# EAGLE schematic CampLight (EAGLE 6.5.0)
Camp Lamp Marky's House
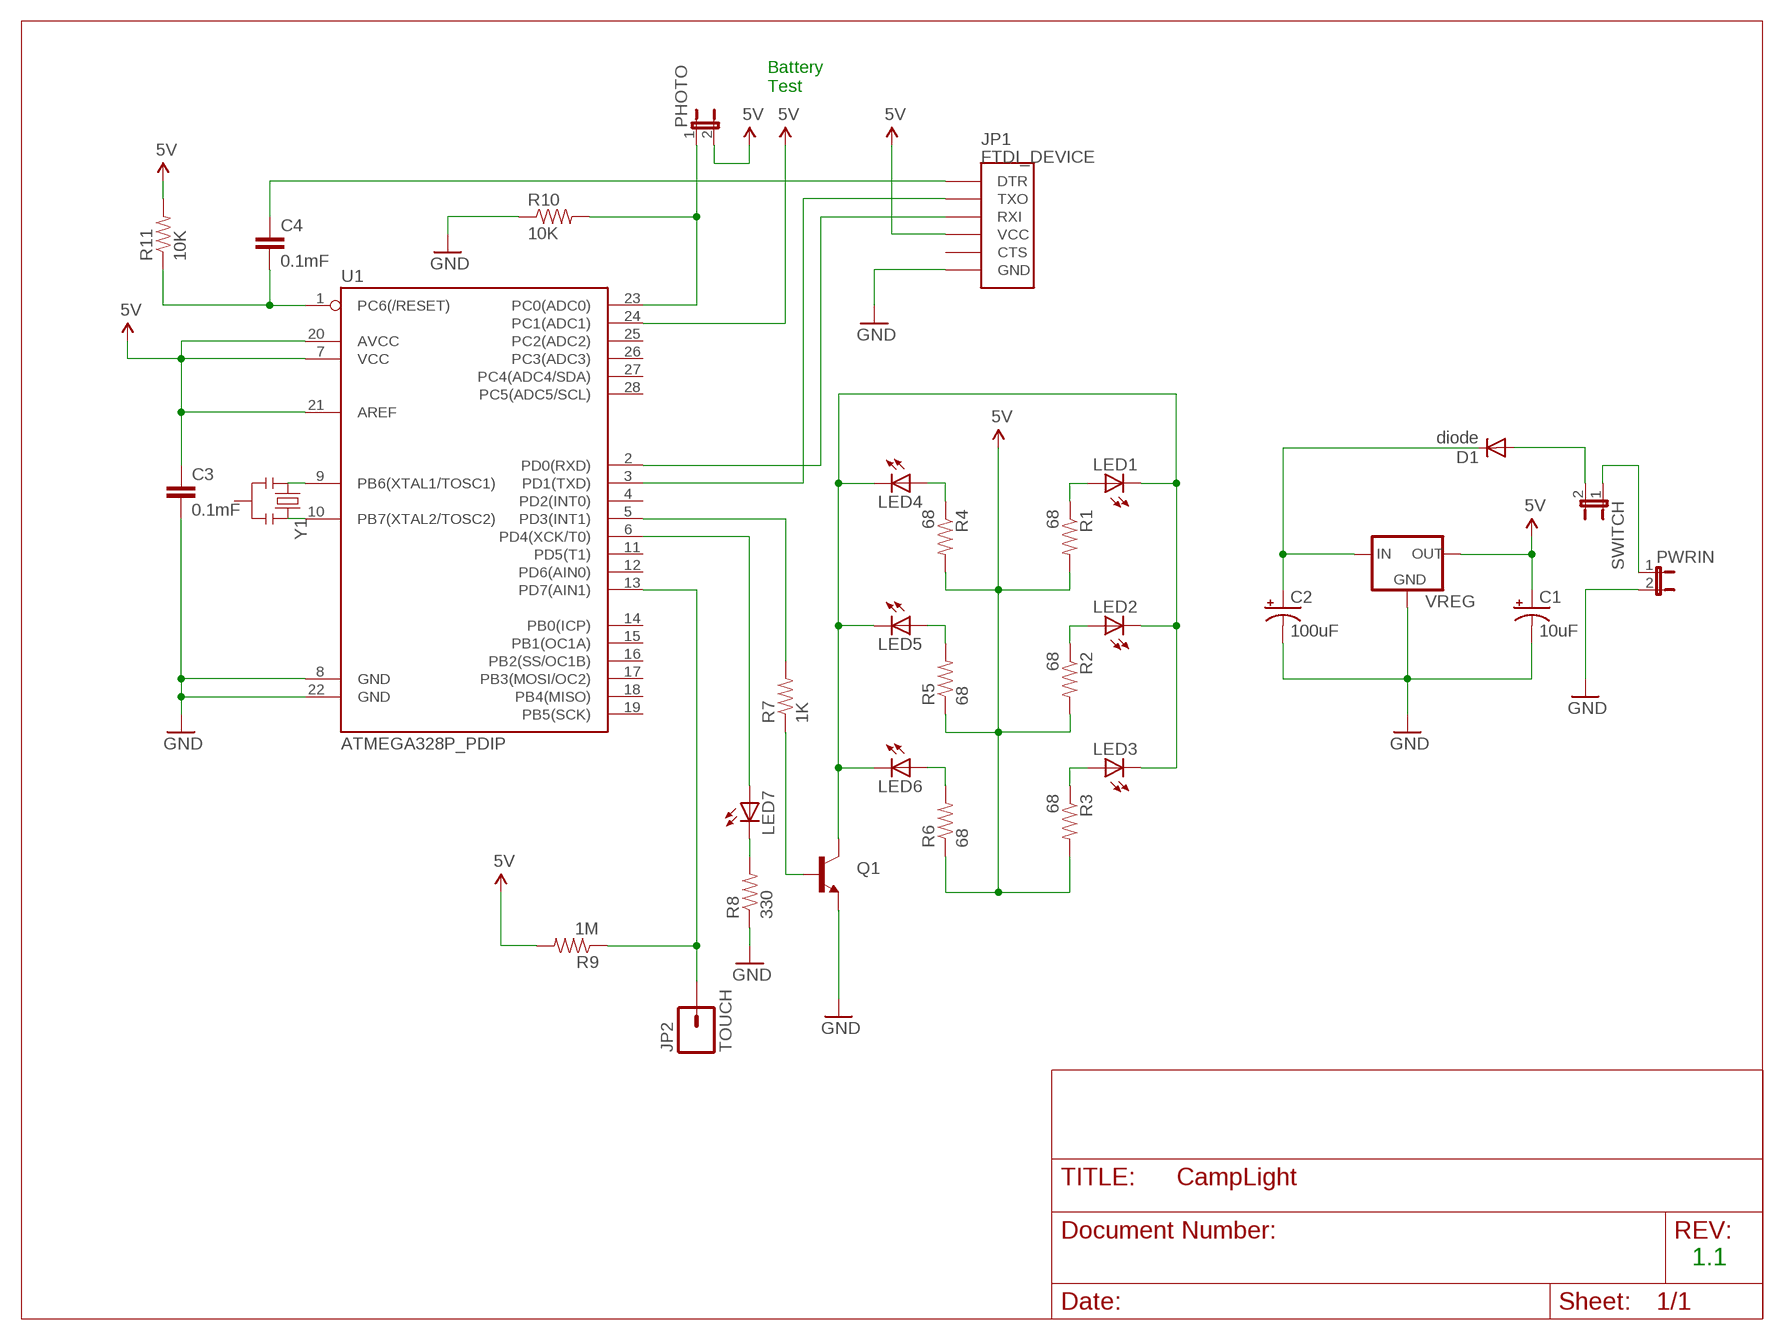
[diagram p0: schematic, sheet 1]

## Parts
C1  10uF  CAP_POLPTH2  [CPOL-RADIAL-10UF-25V]
C2  100uF  CAP_POLPTH2  [CPOL-RADIAL-10UF-25V]
C3  0.1mF  CAPPTH  [CAP-PTH-SMALL]
C4  0.1mF  CAPPTH  [CAP-PTH-SMALL]
D1  diode  DIODEPTH  [DIODE-1N4001]
JP1  FTDI_DEVICE  [FTDI_DEVICE_SIDE]
JP2  TOUCH  M01PTH  [1X01]
LED1  LED5MM  [LED5MM]
LED2  LED5MM  [LED5MM]
LED3  LED5MM  [LED5MM]
LED4  LED5MM  [LED5MM]
LED5  LED5MM  [LED5MM]
LED6  LED5MM  [LED5MM]
LED7  LED3MM  [LED3MM]
PHOTO  JUMPER-2PTH_LOCK  [1X02_LOCK]
PWRIN  JUMPER-2PTH_LOCK  [1X02_LOCK]
Q1  TRANSISTOR_NPNTO-92-AMMO  [TO-92-AMMO]
R1  68  RESISTORAXIAL-0.3  [AXIAL-0.3]
R2  68  RESISTORAXIAL-0.3  [AXIAL-0.3]
R3  68  RESISTORAXIAL-0.3  [AXIAL-0.3]
R4  68  RESISTORAXIAL-0.3  [AXIAL-0.3]
R5  68  RESISTORAXIAL-0.3  [AXIAL-0.3]
R6  68  RESISTORAXIAL-0.3  [AXIAL-0.3]
R7  1K  RESISTORPTH-1/4W  [AXIAL-0.4]
R8  330  RESISTORAXIAL-0.3  [AXIAL-0.3]
R9  1M  RESISTORPTH-1/4W  [AXIAL-0.4]
R10  10K  RESISTORAXIAL-0.3  [AXIAL-0.3]
R11  10K  RESISTORAXIAL-0.3  [AXIAL-0.3]
SWITCH  JUMPER-2PTH_LOCK  [1X02_LOCK]
U1  ATMEGA328P_PDIP  [DIL28-3]
VREG  78LXX  [78LXX]
Y1  RESONATORPTH  [RESONATOR-PTH]

## Nets
5V: C1.1(+) C3.1 JP1.P$4(VCC) PHOTO.2 R1.P$2 R2.P$2 R3.P$2 R4.P$2 R5.P$1 R6.P$1 R9.P$2 R11.P$2 U1.7(VCC) U1.20(AVCC) U1.21(AREF) U1.24(PC1(ADC1)) VREG.OUT
GND: C1.2(-) C2.2(-) C3.2 JP1.P$6(GND) PWRIN.2 Q1.1(E) R8.P$1 R10.P$1 U1.8(GND) U1.22(GND) VREG.GND
N$1: C2.1(+) D1.C VREG.IN
N$2: PWRIN.1 SWITCH.1
N$3: U1.9(PB6(XTAL1/TOSC1)) Y1.1
N$4: U1.10(PB7(XTAL2/TOSC2)) Y1.3
N$5: D1.A SWITCH.2
N$6: R7.P$2 U1.5(PD3(INT1))
N$7: LED1.K(C) LED2.K(C) LED3.K(C) LED4.K(C) LED5.K(C) LED6.K(C) Q1.3(C)
N$8: LED4.A R4.P$1
N$9: LED5.A R5.P$2
N$10: LED1.A R1.P$1
N$11: LED6.A R6.P$2
N$12: JP1.P$3(RXI) U1.2(PD0(RXD))
N$13: LED2.A R2.P$1
N$14: LED3.A R3.P$1
N$15: JP1.P$2(TXO) U1.3(PD1(TXD))
N$16: C4.2 R11.P$1 U1.1(PC6(/RESET))
N$17: C4.1 JP1.P$1(DTR)
N$18: Q1.2(B) R7.P$1
N$19: LED7.K(C) R8.P$2
N$20: LED7.A U1.6(PD4(XCK/T0))
N$21: JP2.1 R9.P$1 U1.13(PD7(AIN1))
N$24: PHOTO.1 R10.P$2 U1.23(PC0(ADC0))
Unconnected: JP1.P$5(CTS) U1.4(PD2(INT0)) U1.11(PD5(T1)) U1.12(PD6(AIN0)) U1.14(PB0(ICP)) U1.15(PB1(OC1A)) U1.16(PB2(SS/OC1B)) U1.17(PB3(MOSI/OC2)) U1.18(PB4(MISO)) U1.19(PB5(SCK)) U1.25(PC2(ADC2)) U1.26(PC3(ADC3)) U1.27(PC4(ADC4/SDA)) U1.28(PC5(ADC5/SCL)) Y1.2

## Notes on the sheet
- Battery
  Test
- 1.1

## Library data of the parts
C1 C2 = SparkFun-Passives:CAP_POL: Capacitor Polarized These are standard SMD and PTH capacitors. Normally 10uF, 47uF, and 100uF in electrolytic and tantalum varieties. Always verify the external diameter of the through hole cap, it varies with capacity, voltage, and manufacturer. The EIA devices should be standard.
C3 C4 = SparkFun-Passives:CAP: Capacitor Standard 0603 ceramic capacitor, and 0.1" leaded capacitor.
D1 = SparkFun-DiscreteSemi:DIODE: Diode These are standard reverse protection diodes and small signal diodes. SMA package can handle up to about 1A. SOD-323 can handle about 200mA. What the SOD-323 package when ordering, there are some mfgs out there that are 5-pin packages.
JP1 = SparkFun-Connectors:FTDI_DEVICE: Connector which mates to FTDI basic or FTDI cable.
JP2 = SparkFun-Connectors:M01: Header 1 Standard 1-pin 0.1" header. Use with straight break away headers (SKU : PRT-00116), right angle break away headers (PRT-00553), swiss pins (PRT-00743), machine pins (PRT-00117), and female headers (PRT-00115).
LED1-LED7 = SparkFun-LED:LED: LEDs Standard schematic elements and footprints for 5mm, 3mm, 1206, and 0603 sized LEDs. 5mm - Spark Fun Electronics SKU : COM-00529 (and others)
PHOTO PWRIN SWITCH = SparkFun-Passives:JUMPER-2: Jumper Basic 0.1" spaced jumper. Use with breakaway headers.
Q1 = SparkFun-DiscreteSemi:TRANSISTOR_NPN: Generic NPN BJT. MMBT2222 is the common NPN we use. Double check against datasheet- not all devices are the same!
R1-R6 R8 R10 R11 = SparkFun-Resistors:RESISTOR: Resistor Basic schematic elements and footprints for 0603, 1206, and PTH resistors.
R7 R9 = SparkFun-Passives:RESISTOR: Resistor Basic schematic elements and footprints for 0603, 1206, and PTH resistors.
U1 = SparkFun-DigitalIC:ATMEGA328P_PDIP: uC used in the Arduino 32kb flash, 1k EEPROM, 2k SRAM This is the through-hole version of this chip.
VREG = v-reg:78LXX: VOLTAGE REGULATOR
Y1 = SparkFun-FreqCtrl:RESONATOR: Resonator Small SMD resonator. Used, eg, on the Arduino Pro/ Pro Mini boards. 8MHz- XTAL-08895 16MHz- XTAL-08900